# EAGLE design DB3AC_Fldigi_Baofeng_V01 (EAGLE 6.6.0)
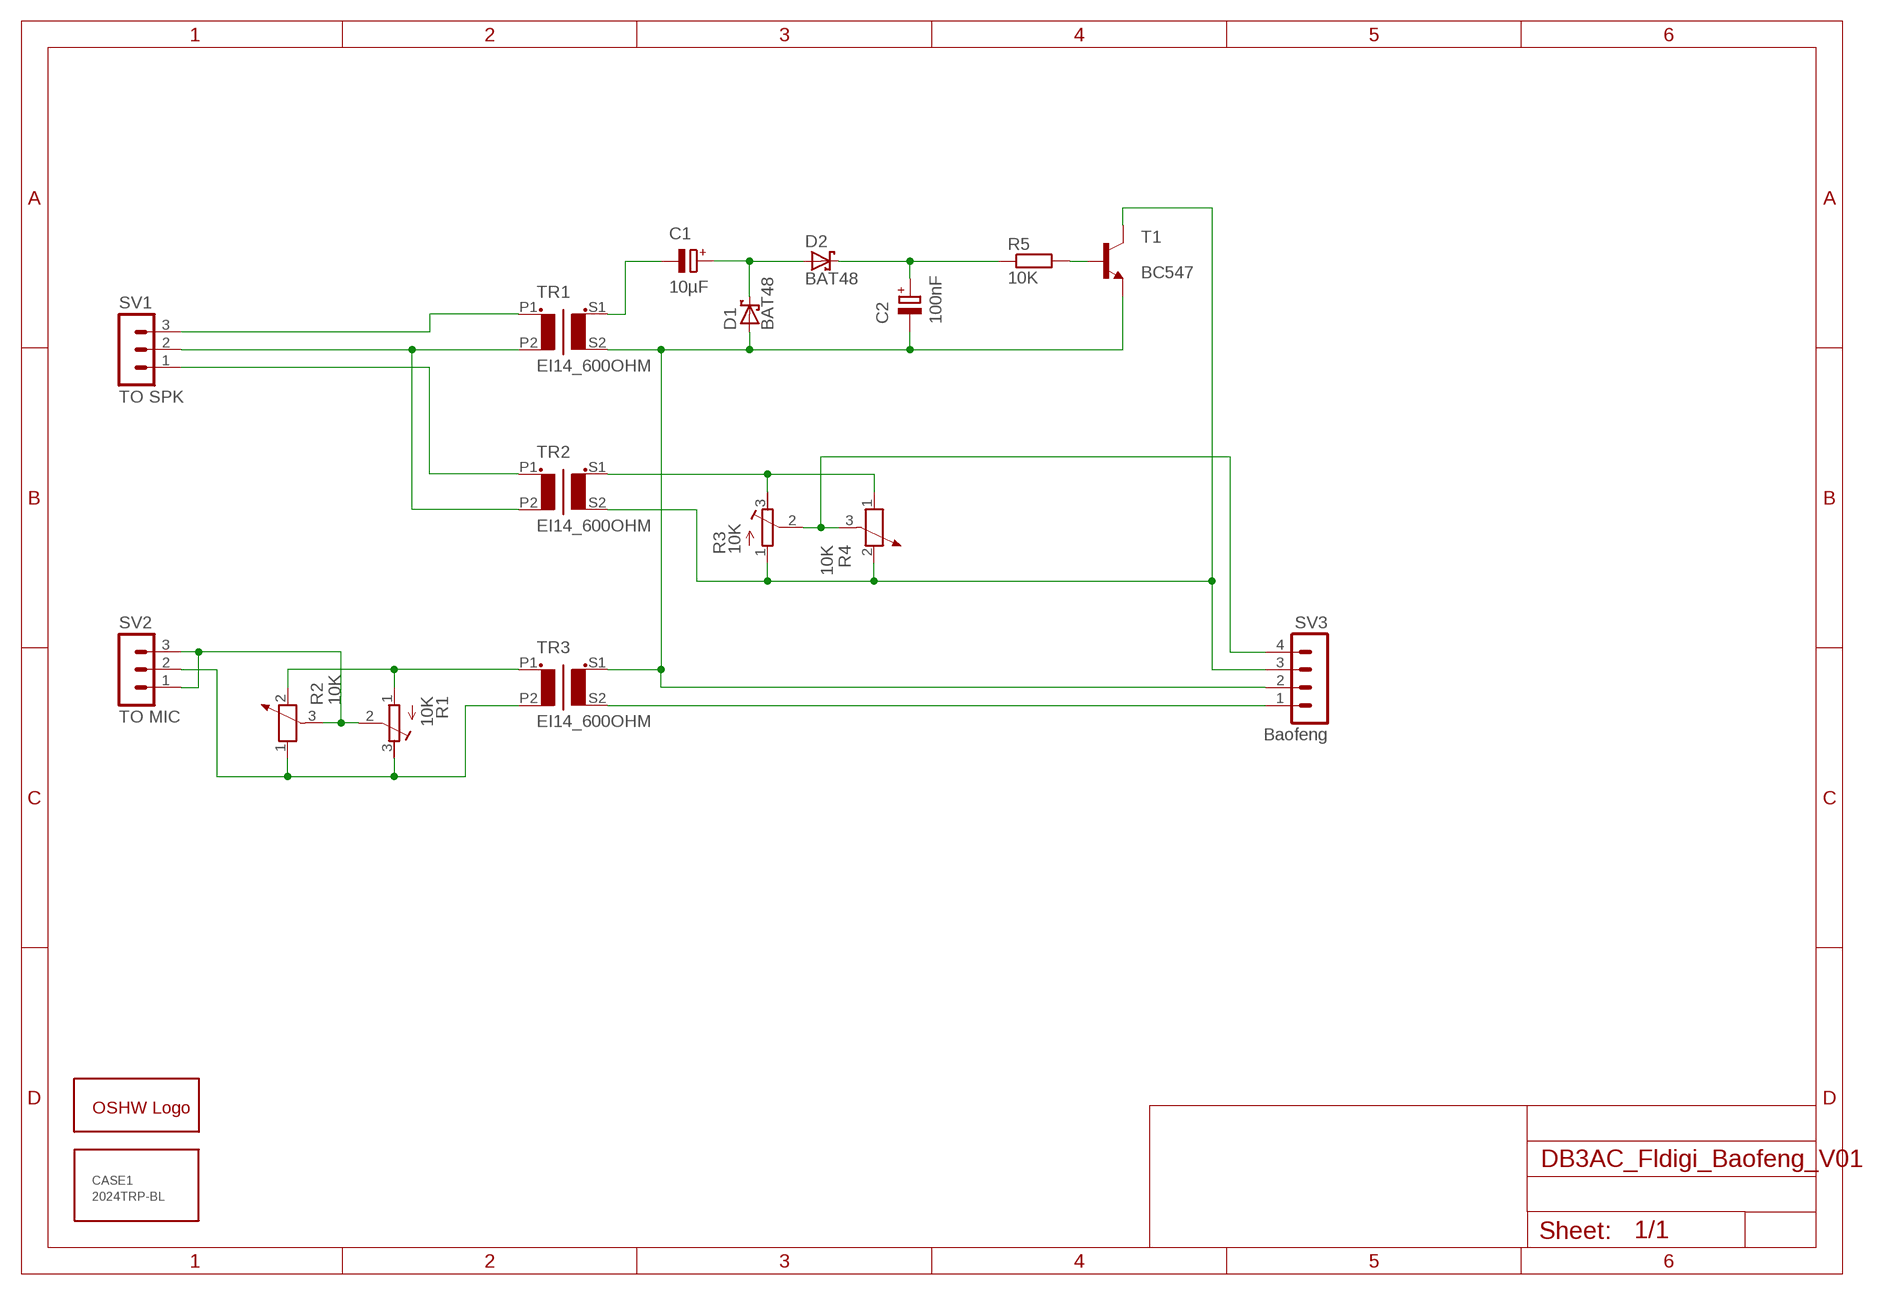
[diagram p0: schematic, sheet 1]

## Parts
C1  10µF  CPOL-EUE2.5-7  [E2,5-7]
C2  100nF  CPOL-EUE2.5-7  [E2,5-7]
CASE1  2024TRP-BL  [2024]
D1  BAT48  BAT42  [DO35-10]
D2  BAT48  BAT42  [DO35-10]
GOLD_ORB_SM1  OSHWLOGOLOGO8MM  [OSHW_8MM]
R1  10K  R-TRIMM3339P  [RTRIM3339P]
R2  10K  POTENTIOMETER_PT-10  [PT-10]
R3  10K  R-TRIMM3339P  [RTRIM3339P]
R4  10K  POTENTIOMETER_PT-10  [PT-10]
R5  10K  R-EU_0204/7  [0204/7]
SV1  TO SPK  MA03-1  [MA03-1]
SV2  TO MIC  MA03-1  [MA03-1]
SV3  Baofeng  MA04-1  [MA04-1]
T1  BC547  BC547-NPN-TO92-CBE  [TO92-CBE]
TR1  EI14_600OHM  [EI14]
TR2  EI14_600OHM  [EI14]
TR3  EI14_600OHM  [EI14]

## Nets
N$1: R1.1(A) R2.2 TR3.P1
N$2: R1.2(S) R2.3 SV2.1 SV2.3
N$3: R3.1(A) R4.2 SV3.3 T1.C TR2.S2
N$4: R3.2(S) R4.3 SV3.4
N$5: C2.- D1.A SV3.2 T1.E TR1.S2 TR3.S1
N$6: R3.3(E) R4.1 TR2.S1
N$7: SV3.1 TR3.S2
N$8: C1.- TR1.S1
N$9: SV1.3 TR1.P1
N$10: SV1.1 TR2.P1
N$11: R5.2 T1.B
N$12: C1.+ D1.C D2.A
N$13: C2.+ D2.C R5.1
N$14: SV1.2 TR1.P2 TR2.P2
N$15: R1.3(E) R2.1 SV2.2 TR3.P2

## Library data of the parts
C1 C2 = rcl:CPOL-EU: POLARIZED CAPACITOR, European symbol
CASE1 = CaseStrapubox:2024: Link: http://strapubox.de/modules/uploadmanager11/admin/index.php?action=file_download&file_id=156&location_id=0; OC_CONRAD: 525967; OC_SEGOR: 2024 trp-bl
D1 D2 = diode:BAT42: DIODE barrier diode
GOLD_ORB_SM1 = oshw:OSHWLOGO: The OSHW logo for PCB layout
R1 R3 = rcl:R-TRIMM: Trimm resistor
R2 R4 = rcl:POTENTIOMETER_: Potentiometer
R5 = rcl:R-EU_: RESISTOR, European symbol
SV1 SV2 = con-lstb:MA03-1: PIN HEADER; OC_FARNELL: unknown; OC_NEWARK: unknown
SV3 = con-lstb:MA04-1: PIN HEADER; OC_FARNELL: unknown; OC_NEWARK: unknown
T1 = transistor:*-NPN-: NPN Transistror BF959 corrected 2008.03.06
TR1-TR3 = TransformerAudio:EI14_600OHM: Audio Transformer 600:600 Ohm 1:1 EI14 Kupplung Isolation Transformator - Modell: EI14 - Material: Nickel-Legierung - AC-Impedanz: EI14 600: 600 Ohm - Artikel: Audio-Transformator - Induktivität: 290mH (±20 %) - DC-Widerstand: 135(±%) - Aufwickelfähigkeit: Double-Draht wicklung - Qualität & Draht-Durchmesser: QS-1 0,06 MM - Primärspulen: 800 Umdrehungen - Sekundären Spulen: 800 Umdrehungen - Abwechseln-Strom Impedanzwert: 600

## Board
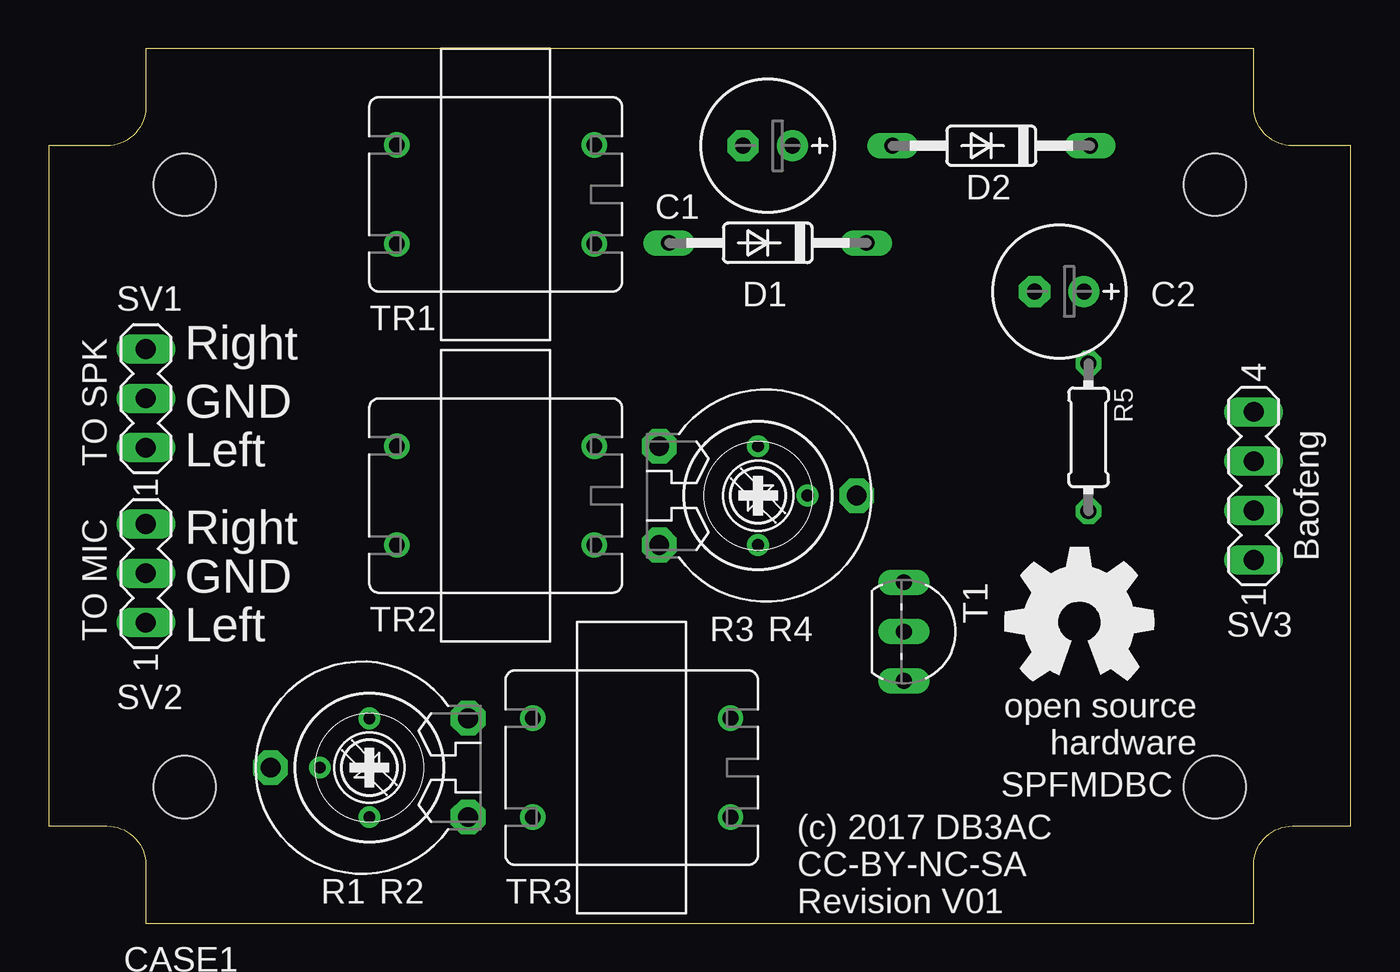
[diagram p1: board, top side]
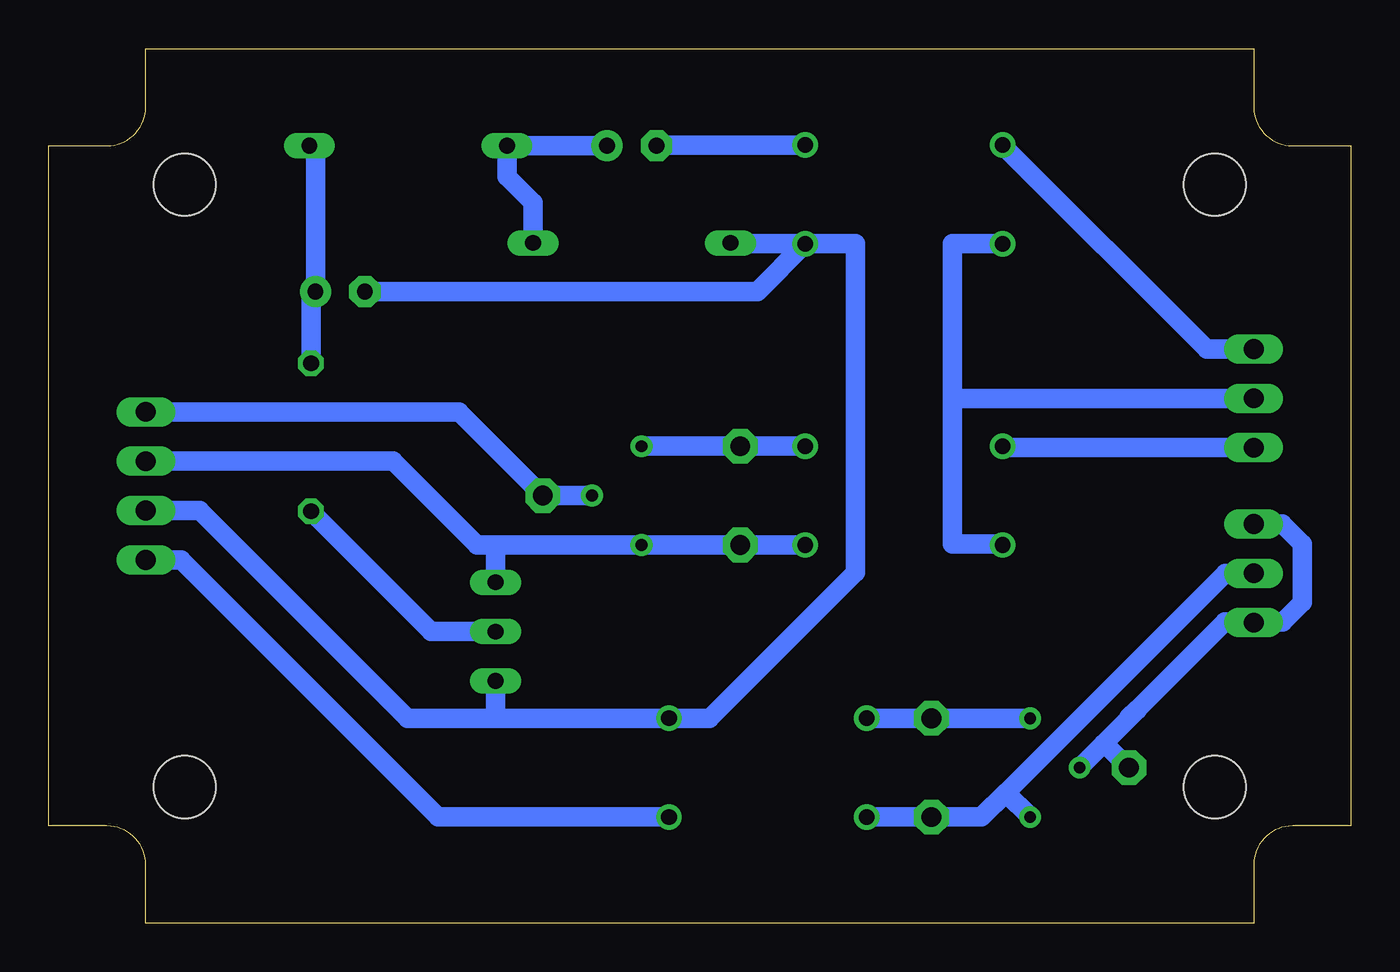
[diagram p2: board, bottom side, seen from below]

Size 67 x 45 mm. Coordinates in mm from the lower left corner, seen from the top.
Copper layers (1*16): Top 0.035mm / dielectric 1.5mm / Bottom 0.035mm
Design rules "default": minimum track width 10mil, minimum drill 24mil, track to track 8mil, track to pad 8mil, pad to pad 8mil, via to via 8mil, smd to smd 8mil, copper to edge 40mil, drill to drill 8mil, minimum pad ring 10mil, minimum via ring 8mil, stop-mask expansion 4mil, vias tented up to drill 0mil, thermal gap 10mil
Holes 3.2 mm at 7,7 7,38 60,38 60,7
tKeepout: area 4,35 to 10,41; area 4,4 to 10,10; area 57,35 to 63,41; area 57,4 to 63,10
bKeepout: area 4,4 to 10,10; area 4,35 to 10,41; area 57,35 to 63,41; area 57,4 to 63,10

### Footprints (pad centres in the part's own frame; a part is rotated, then mirrored left to right if it is on the bottom)
E2,5-7 = drill 0.813 pad 1.6: + -1.27,0 | drill 0.813 pad 1.6 octagon: - 1.27,0
DO35-10 = drill 0.813 long: A 5.08,0; C -5.08,0
RTRIM3339P = drill 0.61: 1 -2.54,0; 2 0,-2.54; 3 2.54,0
PT-10 = drill 1.016 pad 1.778 octagon: 1 -2.54,-5.08; 2 2.54,-5.08; 3 0,5.08
0204/7 = drill 0.813 octagon: 1 -3.81,0; 2 3.81,0
MA03-1 = drill 1.016 long: 1 -2.54,0; 2 0,0; 3 2.54,0
MA04-1 = drill 1.016 long: 1 -3.81,0; 2 -1.27,0; 3 1.27,0; 4 3.81,0
TO92-CBE = drill 0.813 long: B 0,0; C -2.54,0; E 2.54,0
EI14 = drill 0.8 pad 1.27: P1 -5.08,2.54; P2 -5.08,-2.54; S1 5.08,2.54; S2 5.08,-2.54

### Placement (x,y rotation side)
C1  37,40 180 top
C2  52,32.5 180 top
CASE1  0,0 0 top
D1  37,35 180 top
D2  48.5,40 180 top
GOLD_ORB_SM1  53,15.5 0 top
R1  16.5,8 270 top
R2  16.5,8 90 top
R3  36.5,22 90 top
R4  36.5,22 270 top
R5  53.5,25 270 top
SV1  5,27 90 top
SV2  5,18 90 top
SV3  62,22.5 90 top
T1  44,15 270 top
TR1  23,37.5 0 top
TR2  23,22 0 top
TR3  30,8 0 top

### Tracks (layer width: path | path; a pad name or v marks a point on that pad's centre or on a via)
N$1
  Bottom 1: TR3.P1 R2.2 R1.1
N$2
  Bottom 1: 11.42,10.58 11,11 | 11,11 6.5,15.5 5.04,15.5 SV2.1 4.96,15.5 3.5,15.5 2.5,16.5 2.5,19.5 3.54,20.54 SV2.3 | R1.2 12.73,9.23 | 12.73,9.23 11,10.96 11,11 | R2.3 12.65,9.23 12.73,9.23
N$3
  Bottom 1: TR2.S2 R4.2 R3.1 44,19.46 | SV3.3 49.27,23.77 44.96,19.46 44,19.46 | T1.C 44,19.46
N$4
  Bottom 1: R3.2 R4.3 45.89,26.31 SV3.4
N$5
  Bottom 1: TR1.S2 25.5,34.96 25.5,18.04 33,10.54 TR3.S1 44,10.54 | TR1.S2 31.88,34.96 D1.A | 44,10.54 48.54,10.54 59.23,21.23 SV3.2 | C2.- 30.54,32.5 TR1.S2 | T1.E 44,10.54
N$6
  Bottom 1: TR2.S1 R4.1 R3.3
N$7
  Bottom 1: TR3.S2 46.96,5.46 60.19,18.69 SV3.1
N$8
  Bottom 1: TR1.S1 35.69,40.04 C1.-
N$9
  Bottom 1: SV1.3 7.42,29.54 TR1.P1
N$10
  Bottom 1: SV1.1 17.84,24.46 TR2.P1
N$11
  Bottom 1: T1.B 47.31,15 R5.2
N$12
  Bottom 1: C1.+ D2.A 43.42,38.42 42.08,37.08 D1.C
N$13
  Bottom 1: D2.C 53.27,39.69 C2.+ 53.5,32.27 R5.1
N$14
  Bottom 1: TR1.P2 20.5,34.96 20.5,27 | 20.5,27 20.5,19.5 17.92,19.5 TR2.P2 | SV1.2 20.5,27
N$15
  Bottom 1: TR3.P2 R2.1 19,5.46 17.73,6.73 | SV2.2 6.46,18 17.73,6.73 | R1.3 17.73,6.69 17.73,6.73

### Text on the board
tNames: Right | GND | Left | Right | GND | Left | SPFMDBC | (c) 2017 DB3AC / CC-BY-NC-SA / Revision V01